# Altium schematic sheet MIPI-CSI.SchDoc: Dahlia Carrier Board
size A3; Organization: Toradex AG; Address1: Ebenaustrasse 10; Address2: Horw; Address3: 6048; Address4: Switzerland; DocumentNumber: 11; Revision: V1.1; SheetNumber: 11; SheetTotal: 21; PageSetup: Record=PageOptions|CenterHorizontal=True|CenterVertical=True|PrintScale=0.71|XCorrection=1.00|YCorrection=1.00|PrintKind=1|BorderSize=5000000|LeftOffset=0|BottomOffset=0|Orientation=2|PaperLength=1000|PaperWidth=1000|Scale=100|PaperSource=15|PrintQuality=600|MediaType=1|DitherType=10|PaperKind=A4|PrintScaleMode=1
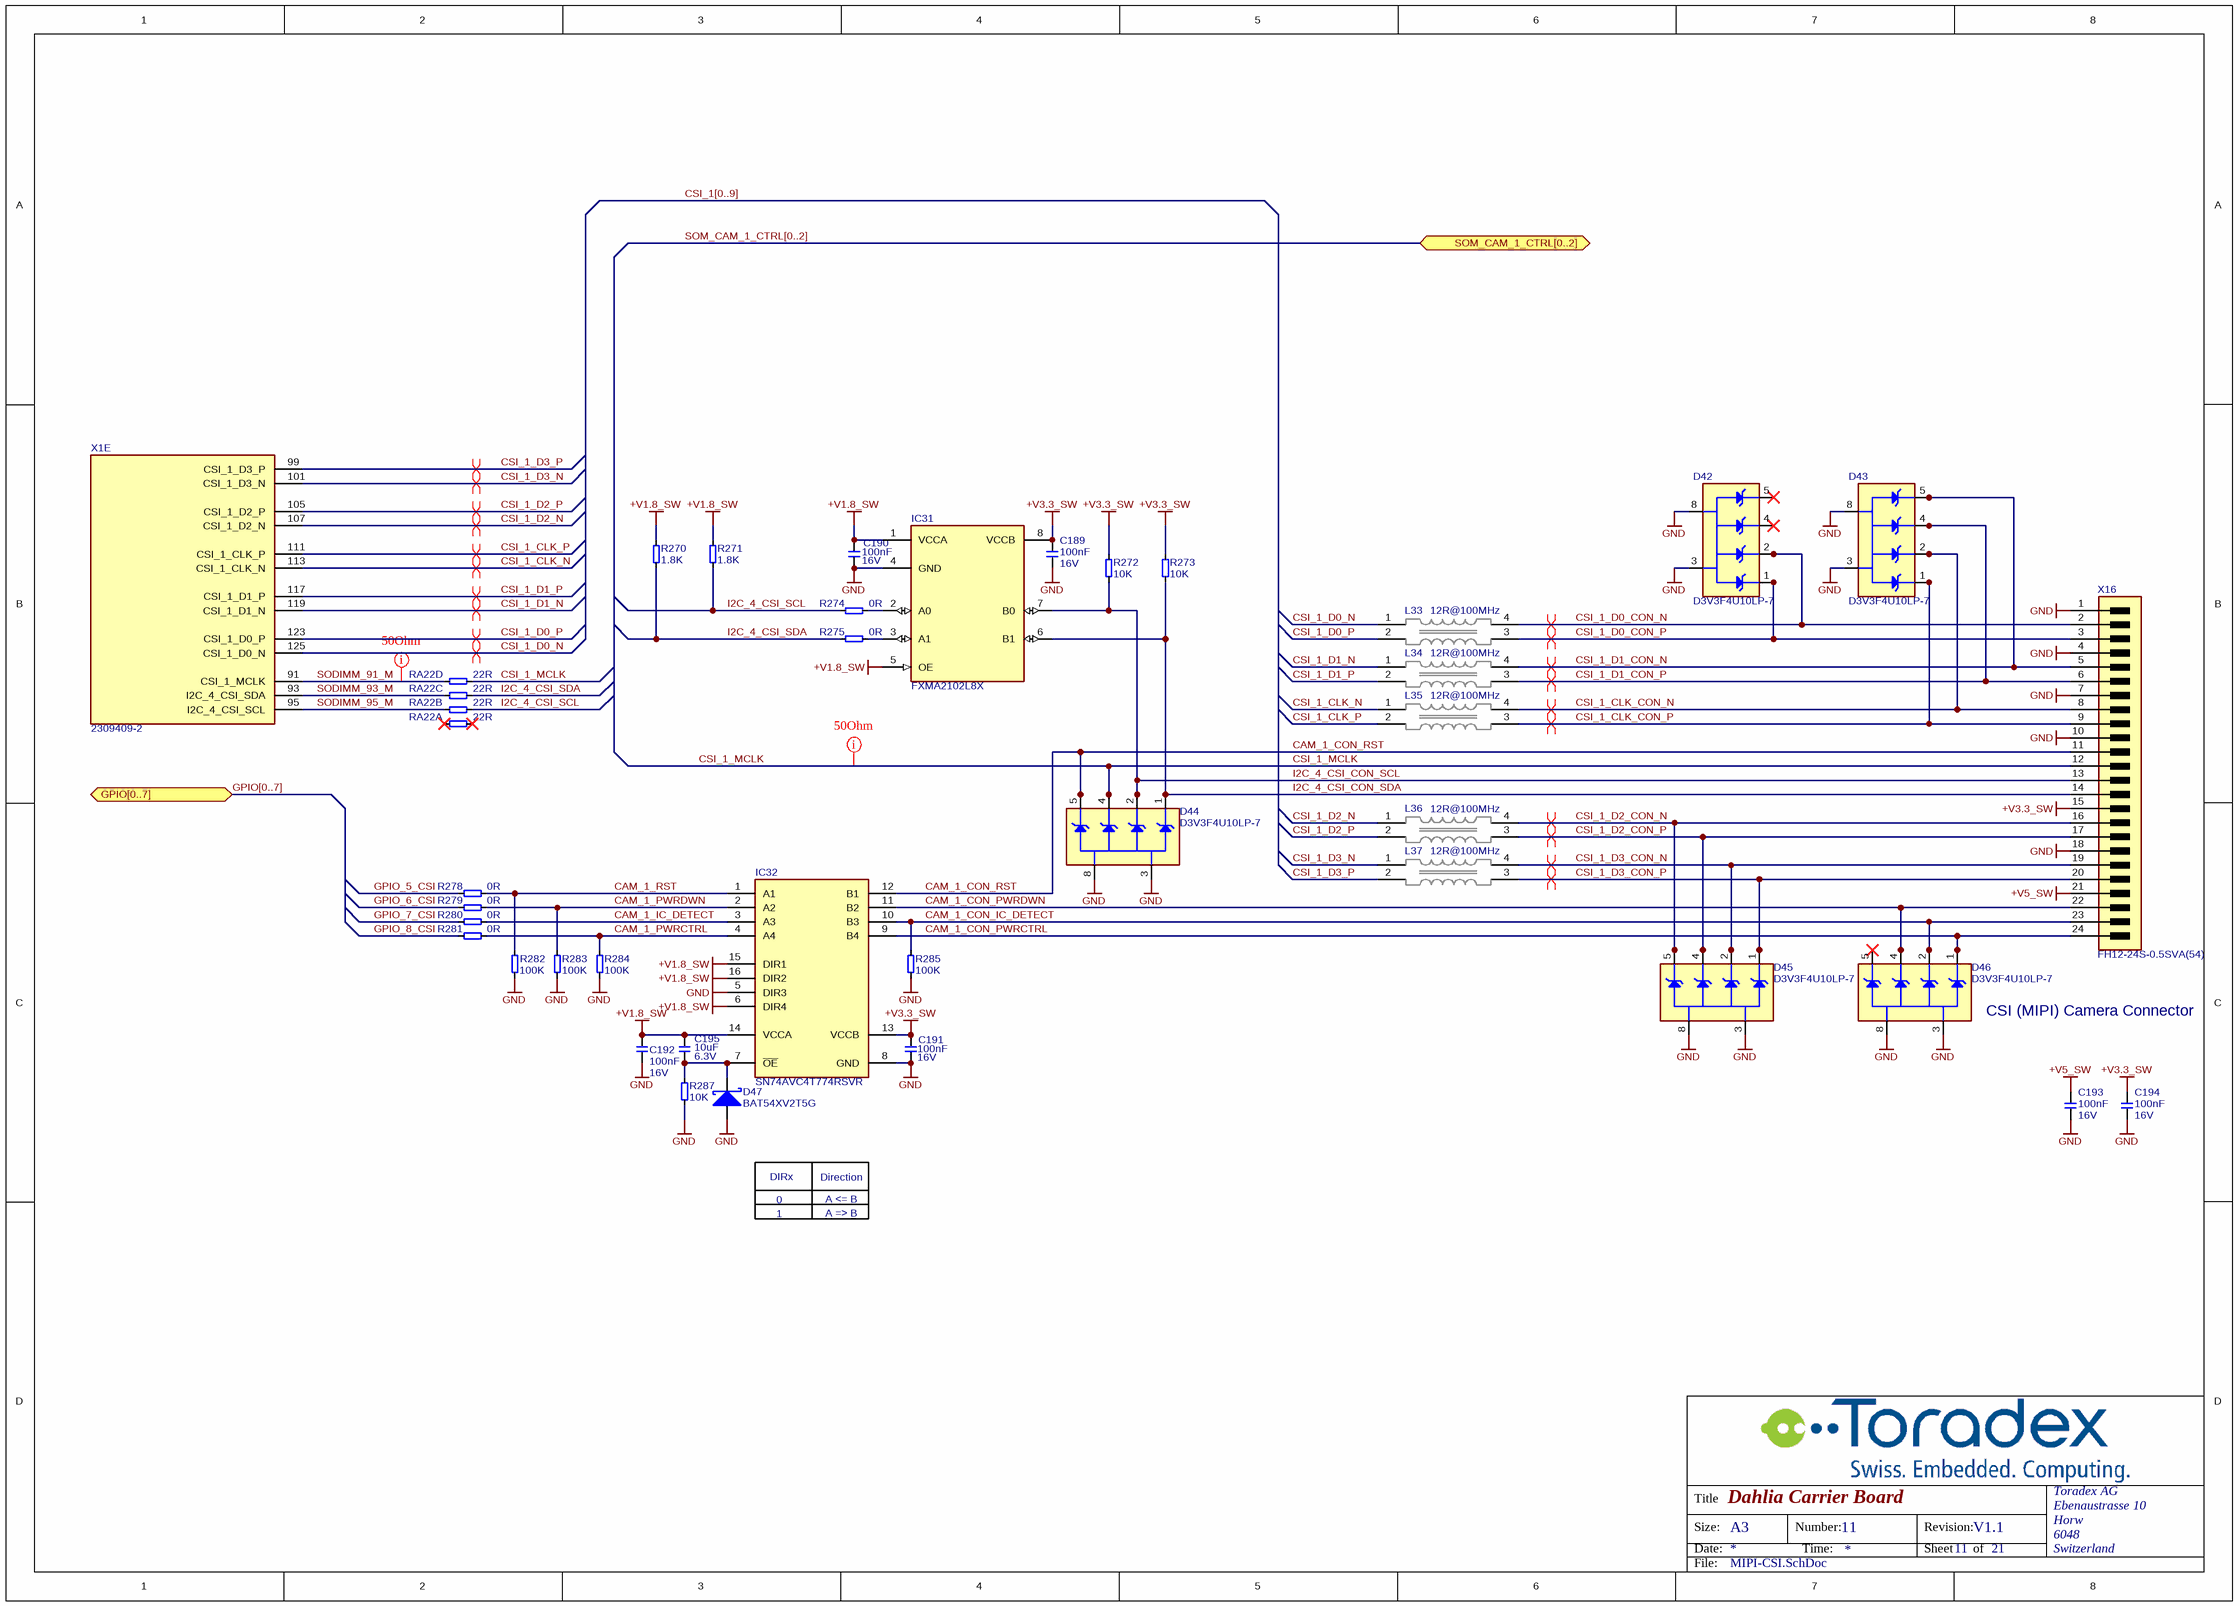
[diagram p0: MIPI-CSI.SchDoc]

## Parts
C189  Rating: 16V  [CAPC1005X60N]  (hidden comment: 100nF)
C190  Rating: 16V  [CAPC1005X60N]  (hidden comment: 100nF)
C191  Rating: 16V  [CAPC1005X60N]  (hidden comment: 100nF)
C192  Rating: 16V  [CAPC1005X60N]  (hidden comment: 100nF)
C193  Rating: 16V  [CAPC1005X60N]  (hidden comment: 100nF)
C194  Rating: 16V  [CAPC1005X60N]  (hidden comment: 100nF)
C195  Rating: 6.3V  [CAPC1005X60N]  (hidden comment: 10uF)
D42  D3V3F4U10LP-7  [D-Diodes-D3V3F4U10LP-7]
D43  D3V3F4U10LP-7  [D-Diodes-D3V3F4U10LP-7]
D44  D3V3F4U10LP-7  [D-Diodes-D3V3F4U10LP-7]
D45  D3V3F4U10LP-7  [D-Diodes-D3V3F4U10LP-7]
D46  D3V3F4U10LP-7  [D-Diodes-D3V3F4U10LP-7]
D47  BAT54XV2T5G  [SOD-523]
IC31  FXMA2102L8X  [IC-MicroPak50P160X2160X55-8N]
IC32  SN74AVC4T774RSVR  [IC-UQFN40P180X210X55-16N]
L33  12R@100MHz  [T_Panasonic_EXC14CH120U]
L34  12R@100MHz  [T_Panasonic_EXC14CH120U]
L35  12R@100MHz  [T_Panasonic_EXC14CH120U]
L36  12R@100MHz  [T_Panasonic_EXC14CH120U]
L37  12R@100MHz  [T_Panasonic_EXC14CH120U]
R270  1.8K  [RESC1005X40N]
R271  1.8K  [RESC1005X40N]
R272  10K  [RESC1005X40N]
R273  10K  [RESC1005X40N]
R274  0R  [T_RESC0603X30N]
R275  0R  [T_RESC0603X30N]
R278  0R  [T_RESC0603X30N]
R279  0R  [T_RESC0603X30N]
R280  0R  [T_RESC0603X30N]
R281  0R  [T_RESC0603X30N]
R282  100K  [RESC1005X40N]
R283  100K  [RESC1005X40N]
R284  100K  [RESC1005X40N]
R285  100K  [RESC1005X40N]
R287  10K  [RESC1005X40N]
RA22  22R  [T_Resistor_Array_X4]  (parts A,B,C,D of 4)
X1  2309409-2  [CON-TE-2309409-2-SOLDERABLE-STANDOFFS]  (part E of 23)
X16  FH12-24S-0.5SVA(54)  [T_Hirose_FH12-24S-0.5SVA(54)]

## Ports
GPIO[0..7] (bidir), SOM_CAM_1_CTRL[0..2] (bidir)

## Nets
+V1.8_SW: C190.2 C192.2 C195.2 IC31.1(VCCA) IC31.5(OE) IC32.6(DIR4) IC32.14(VCCA) IC32.15(DIR1) IC32.16(DIR2) R270.1 R271.1
+V3.3_SW: C189.2 C191.2 C194.2 IC31.8(VCCB) IC32.13(VCCB) R272.2 R273.2 X16.15(DDC_CLK)
+V5_SW: C193.2 X16.21(GND)
GND: C189.1 C190.1 C191.1 C192.1 C193.1 C194.1 D42.3 D42.8 D43.3 D43.8 D44.3 D44.8 D45.3 D45.8 D46.3 D46.8 D47.A IC31.4(GND) IC32.5(DIR3) IC32.8(GND) R282.2 R283.2 R284.2 R285.1 R287.1 X16.1(GND) X16.4(GND) X16.7(GND) X16.10(GND) X16.18(CRT_RED)
CAM_1_CON_IC_DETECT: D46.2 D46.9 IC32.10(B3) R285.2 X16.23(CRT_VSYNC)
CAM_1_CON_PWRCTRL: D46.1 D46.10 IC32.9(B4) X16.24(CRT_HSYNC)
CAM_1_CON_PWRDWN: D46.4 D46.7 IC32.11(B2) X16.22(CRT_BLUE)
CAM_1_CON_RST: D44.5 D44.6 IC32.12(B1) X16.11(TMDS_DATA2_P)
CAM_1_IC_DETECT: IC32.3(A3) R280.1
CAM_1_PWRCTRL: IC32.4(A4) R281.1 R284.1
CAM_1_PWRDWN: IC32.2(A2) R279.1 R283.1
CAM_1_RST: IC32.1(A1) R278.1 R282.1
CSI_1_CLK_CON_N: D43.2 D43.9 L35.4 X16.8(TMDS_DATA1_P)
CSI_1_CLK_CON_P: D43.1 D43.10 L35.3 X16.9(TMDS_DATA1_N)
CSI_1_CLK_N: L35.1 X1.113(CSI_1_CLK_N)
CSI_1_CLK_P: L35.2 X1.111(CSI_1_CLK_P)
CSI_1_D0_CON_N: D42.2 D42.9 L33.4 X16.2(TMDS_CLK_P)
CSI_1_D0_CON_P: D42.1 D42.10 L33.3 X16.3(TMDS_CLK_N)
CSI_1_D0_N: L33.1 X1.125(CSI_1_D0_N)
CSI_1_D0_P: L33.2 X1.123(CSI_1_D0_P)
CSI_1_D1_CON_N: D43.5 D43.6 L34.4 X16.5(TMDS_DATA0_P)
CSI_1_D1_CON_P: D43.4 D43.7 L34.3 X16.6(TMDS_DATA0_N)
CSI_1_D1_N: L34.1 X1.119(CSI_1_D1_N)
CSI_1_D1_P: L34.2 X1.117(CSI_1_D1_P)
CSI_1_D2_CON_N: D45.5 D45.6 L36.4 X16.16(DDC_DATA)
CSI_1_D2_CON_P: D45.4 D45.7 L36.3 X16.17(GND)
CSI_1_D2_N: L36.1 X1.107(CSI_1_D2_N)
CSI_1_D2_P: L36.2 X1.105(CSI_1_D2_P)
CSI_1_D3_CON_N: D45.2 D45.9 L37.4 X16.19(GND)
CSI_1_D3_CON_P: D45.1 D45.10 L37.3 X16.20(CRT_GREEN)
CSI_1_D3_N: L37.1 X1.101(CSI_1_D3_N)
CSI_1_D3_P: L37.2 X1.99(CSI_1_D3_P)
CSI_1_MCLK: D44.4 D44.7 RA22.8 X16.12(TMDS_DATA2_N)
GPIO_5_CSI: R278.2
GPIO_6_CSI: R279.2
GPIO_7_CSI: R280.2
GPIO_8_CSI: R281.2
I2C_4_CSI_CON_SCL: D44.2 D44.9 IC31.7(B0) R272.1 X16.13(VDD)
I2C_4_CSI_CON_SDA: D44.1 D44.10 IC31.6(B1) R273.1 X16.14(HOTPLUG_DETECT)
I2C_4_CSI_SCL: R271.2 R274.2 RA22.6
I2C_4_CSI_SDA: R270.2 R275.2 RA22.7
SODIMM_91_M: RA22.4 X1.91(CSI_1_MCLK)
SODIMM_93_M: RA22.3 X1.93(I2C_4_CSI_SDA)
SODIMM_95_M: RA22.2 X1.95(I2C_4_CSI_SCL)
NetC195_1: C195.1 D47.C IC32.7(~{OE}) R287.2
NetD42_4: D42.4 D42.7
NetD42_5: D42.5 D42.6
NetD46_5: D46.5 D46.6
NetIC31_2: IC31.2(A0) R274.1
NetIC31_3: IC31.3(A1) R275.1

Not connected (* = marked no-connect by the designer): RA22 1* 5*

## Buses and harness runs
bus CSI_1[0..9]
bus GPIO[0..7] = port GPIO[0..7]
bus SOM_CAM_1_CTRL[0..2] = port SOM_CAM_1_CTRL[0..2]

## Layout directives
differential pair; differential pair class CSI: CSI_1_CLK_CON_N, CSI_1_CLK_CON_P, CSI_1_CLK_N, CSI_1_CLK_P, CSI_1_D0_CON_N, CSI_1_D0_CON_P, CSI_1_D0_N, CSI_1_D0_P, CSI_1_D1_CON_N, CSI_1_D1_CON_P, CSI_1_D1_N, CSI_1_D1_P, CSI_1_D2_CON_N, CSI_1_D2_CON_P, CSI_1_D2_N, CSI_1_D2_P, CSI_1_D3_CON_N, CSI_1_D3_CON_P, CSI_1_D3_N, CSI_1_D3_P
net class 50Ohm: CSI_1_MCLK, SODIMM_91_M

## Notes on the sheet
- (near D46) CSI (MIPI) Camera Connector
- DIRx
- 0
- Direction
- A <= B
- 1
- A => B
- Title
- Size:
- Date:
- A3
- Number:
- Time:
- Revision:
- Sheet
- of
- File:

## Library data of the parts
C189-C194 = C-X7R-100nF-16V-10%-0402: Capacitor Ceramic X7R 100nF 16V 10% 0402; Tolerance: 10%; Type: X7R; Value: 100nF
C195 = C-X5R-10u-6.3V-20%-0402: Capacitor Ceramic X5R 10uF 6.3V 20% 0402; Tolerance: 20%; Type: X5R; Value: 10uF
D42-D46 = D-Diodes-D3V3F4U10LP-7: 4 CHANNEL LOW CAPACITANCE TVS DIODE ARRAY; Manufacturer Name: Nexperia; Manufacturer Part No.: D3V3F4U10LP-7
D47 = D-BAT54-SOD523: Schottky Barrier Rectifier; Manufacturer Name: On Semi; Manufacturer Part No.: BAT54XV2T5G
IC31 = IC-ONsemi-FXMA2102L8X: Voltage Level Translator for I2C Applications; Manufacturer Name: ONSemi; Manufacturer Part No.: FXMA2102L8X
IC32 = IC-TI-SN74AVC4T774RSVR: 4 Bit Bidirectional l Voltage Level Translator, Configurable Direction, UFQFN-16 package; Manufacturer Name: Texas Instruments; Manufacturer Part No.: SN74AVC4T774RSVR
L33-L37 = L-Panasonic-EXC14CH120U-12R@100MHz-1000mA-25%: Common Mode Choke High Speed 12R 100mA; Tolerance: 25%; Rating: 100mA; Manufacturer Name: Panasonic; Manufacturer Part No.: EXC14CH120U; Value: 12R@100MHz
R270 R271 = R-1.8K-63mW-5%-0402: Resistor 1.8 Kohm 63mW 5% 0402; Rating: 63mW; Tolerance: 5%; Value: 1.8K
R272 R273 R287 = R-10K-63mW-5%-0402: Resistor 10 Kohm 63mW 5% 0402; Rating: 63mW; Tolerance: 5%; Value: 10K
R274 R275 R278-R281 = R-0R-63mW-1%-0603: Resistor 0 ohm 63mW 1% 0603; Rating: 63mW; Tolerance: 1%; Value: 0R
R282-R285 = R-100K-63mW-5%-0402: Resistor 100 Kohm 63mW 5% 0402; Rating: 63mW; Tolerance: 5%; Value: 100K
RA22 = RA-22R-63mW-5%-1206-div: Resistor Array 22 R 63mW 5% 1206; Tolerance: 5%; Power Dissipation: 63mW; Value: 22R
X1 = CON-TE-2309409-2: DDR4 SODIMM Socket, 260 pins, 5.2mm(H), 0.5mm Pitch; Manufacturer Name: TE; Temperature Range: -40C to +125C; Package: DDR4-SODIMM-260; Manufacturer Part No.: 2309409-2
X16 = CON-Hirose-FH12-24S-0.5SVA(54)-0.5mm: 0.50mm Pitch FFC/FPC Vertical DVI Connector; Manufacturer Name: Hirose; No. of ways: 24; Pitch: 0.5mm; Manufacturer Part No.: FH12-24S-0.5SVA(54)